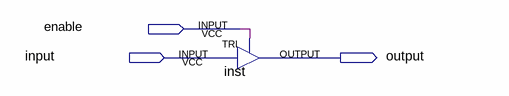
[diagram p0: schematic sheet]
// Quartus schematic triStateBuffer.bdf as structural Verilog: 1 symbols, 3 pins
module triStateBuffer (
  input  enable,
  input  \input ,
  output \output 
);

  TRI inst (.IN(\input ), .OE(enable), .OUT(\output ));
endmodule
